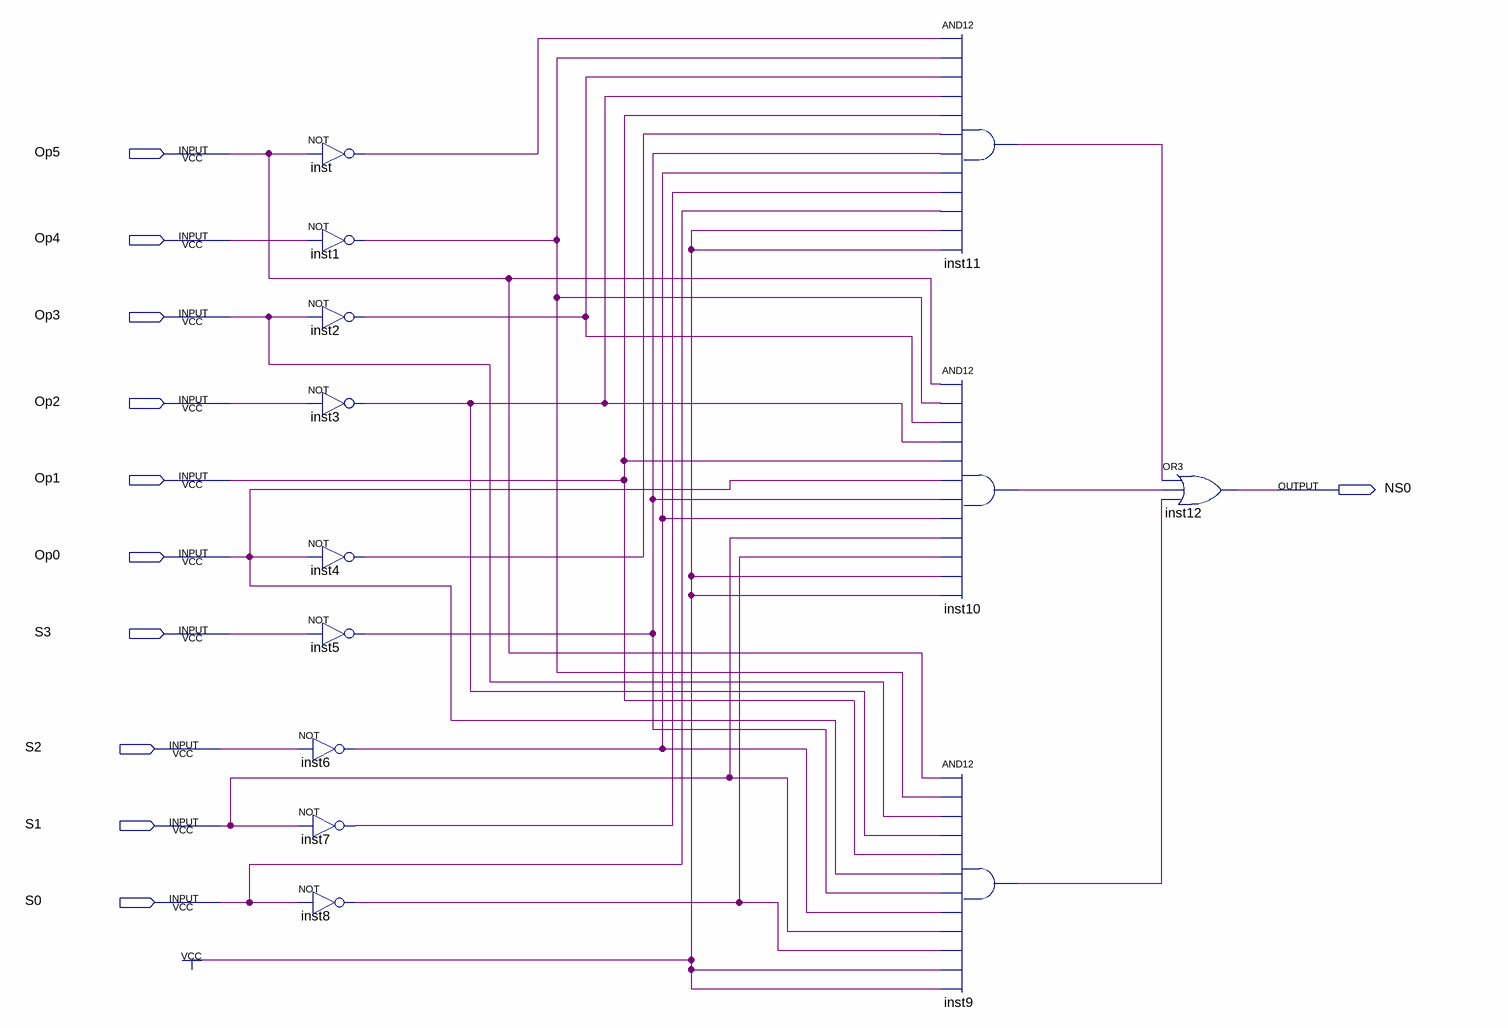
[diagram p0: schematic sheet]
// Quartus schematic NS0.bdf as structural Verilog: 13 symbols, 11 pins
module NS0 (
  input  Op5,
  input  Op4,
  input  Op3,
  input  Op2,
  input  Op1,
  input  Op0,
  input  S3,
  input  S2,
  input  S1,
  input  S0,
  output NS0
);

  wire inst1_out, inst2_out, inst3_out, inst4_out, inst5_out, inst6_out, inst7_out, inst8_out, inst9_out,
       inst10_out, inst11_out, inst_out;

  not inst (inst_out, Op5);
  not inst1 (inst1_out, Op4);
  not inst2 (inst2_out, Op3);
  not inst3 (inst3_out, Op2);
  not inst4 (inst4_out, Op0);
  not inst5 (inst5_out, S3);
  not inst6 (inst6_out, S2);
  not inst7 (inst7_out, S1);
  not inst8 (inst8_out, S0);
  and inst11 (inst11_out, inst_out, inst1_out, inst2_out, inst3_out, Op1, inst4_out, inst5_out, inst6_out, inst7_out, S0, 1'b1, 1'b1);
  and inst10 (inst10_out, Op5, inst1_out, inst2_out, inst3_out, Op1, Op0, inst5_out, inst6_out, S1, inst8_out, 1'b1, 1'b1);
  and inst9 (inst9_out, Op5, inst1_out, Op3, inst3_out, Op1, Op0, inst5_out, inst6_out, S1, inst8_out, 1'b1, 1'b1);
  or inst12 (NS0, inst11_out, inst10_out, inst9_out);
endmodule
